# EAGLE design neopixel_board2 (EAGLE 9.2.0)
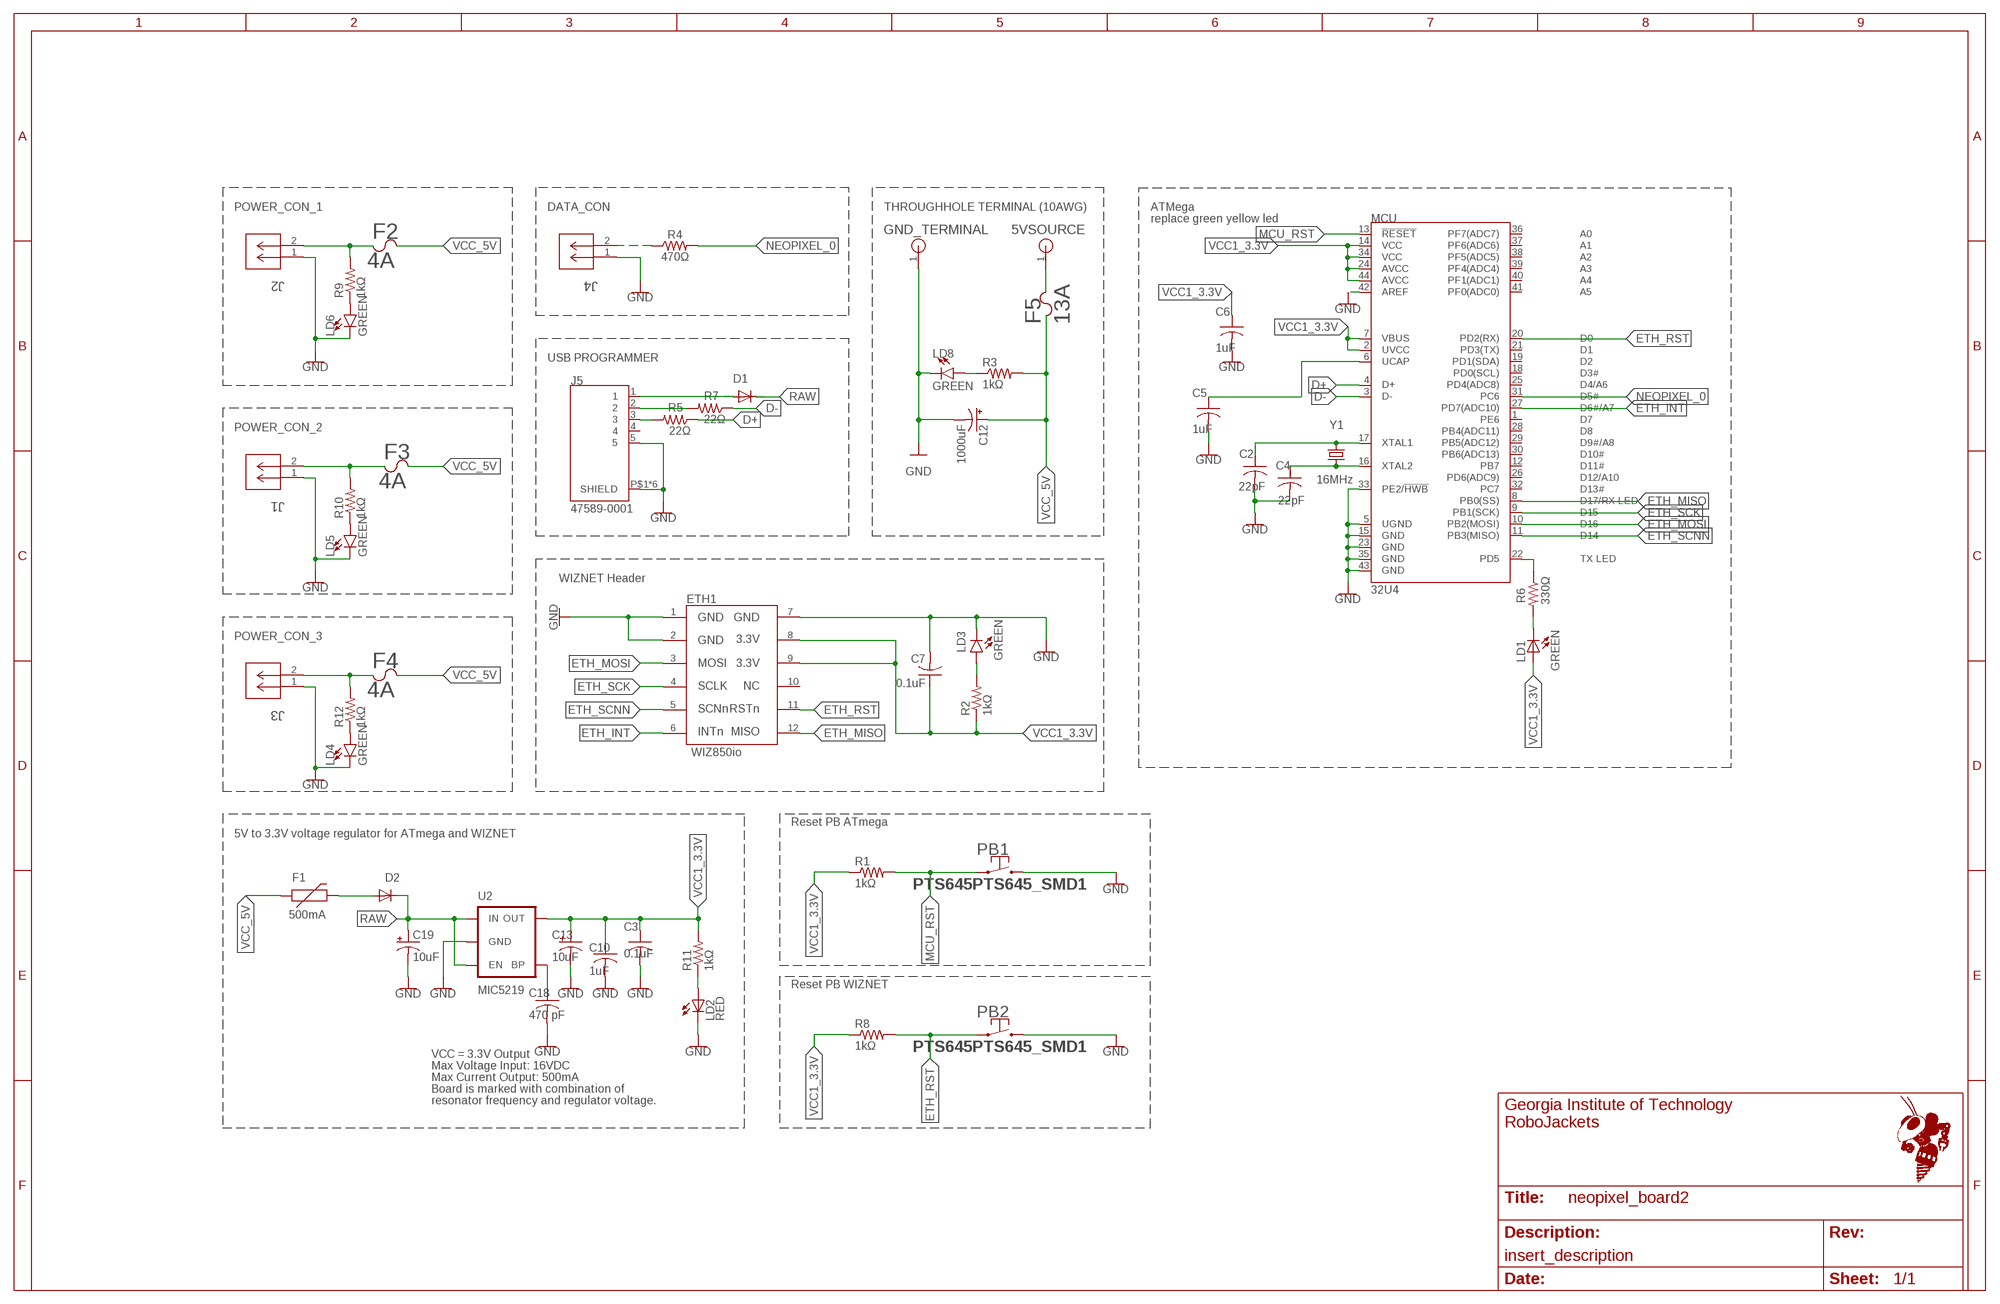
[diagram p0: schematic, sheet 1]
FRAME2 (FRAME_B_L): SCH_DESC: insert_description

## Parts
5VSOURCE  THOLE_SOURCE  [THOLE_SOURCE]
C2  22pF  C-USC0603  [C0603]
C3  0.1uF  C-USC0603  [C0603]
C4  22pF  C-USC0603  [C0603]
C5  1uF  C-USC0603  [C0603]
C6  1uF  C-USC0603  [C0603]
C7  0.1uF  C-USC0603  [C0603]
C10  1uF  C-USC0603  [C0603]
C12  1000uF  CAP_POL1206  [EIA3216]
C13  10uF  CAP_POL1206  [EIA3216]
C18  470 pF  C-USC0603  [C0603]
C19  10uF  CAP_POL1206  [EIA3216]
D1  DIODE-SOD110-W  [SOD110-W]
D2  DIODESOD  [SOD-323]
ETH1  WIZ850IO  [WIZ850IO]
F1  500mA  PTCSMD  [PTC-1206]
F2  4A  3557-2  [3557-2]
F3  4A  3557-2  [3557-2]
F4  4A  3557-2  [3557-2]
F5  13A  3557-2  [3557-2]
GND_TERMINAL  THOLE_SOURCE  [THOLE_SOURCE]
J1  SSW-102-02-T-S-RA  [CON2_1X2_TR_SSQ]
J2  SSW-102-02-T-S-RA  [CON2_1X2_TR_SSQ]
J3  SSW-102-02-T-S-RA  [CON2_1X2_TR_SSQ]
J4  SSW-102-02-T-S-RA  [CON2_1X2_TR_SSQ]
J5  47589-0001  [MOLEX_47589-0001]
LD1  GREEN  LED0603  [LED-0603]
LD2  RED  LED0603  [LED-0603]
LD3  GREEN  LED-GREEN0603  [LED-0603]
LD4  GREEN  LED-GREEN0603  [LED-0603]
LD5  GREEN  LED-GREEN0603  [LED-0603]
LD6  GREEN  LED-GREEN0603  [LED-0603]
LD8  GREEN  LED-GREEN0603  [LED-0603]
MCU  32U4  ATMEGA32U4TQFP-44  [TQFP44]
PB1  PTS645PTS645_SMD1  [PTS645_SMD]
PB2  PTS645PTS645_SMD1  [PTS645_SMD]
R1  1kΩ  R-US_R0603  [R0603]
R2  1kΩ  R-US_R0603  [R0603]
R3  1kΩ  RESISTOR0603-RES  [0603-RES]
R4  470Ω  470OHM-0603-1/10W-1%  [0603]
R5  22Ω  RESISTOR0603-RES  [0603-RES]
R6  330Ω  RESISTOR0603-RES  [0603-RES]
R7  22Ω  RESISTOR0603-RES  [0603-RES]
R8  1kΩ  R-US_R0603  [R0603]
R9  1kΩ  RESISTOR0603-RES  [0603-RES]
R10  1kΩ  RESISTOR0603-RES  [0603-RES]
R11  1kΩ  RESISTOR0603-RES  [0603-RES]
R12  1kΩ  RESISTOR0603-RES  [0603-RES]
U2  MIC5219  V_REG_LDOSMD  [SOT23-5]
Y1  16MHz  CRYSTAL5X3  [CRYSTAL-SMD-5X3]

## Nets
5VIN: 5VSOURCE.1 F5.1 F5.2
D+: MCU.4(D+) R5.1
D-: MCU.3(D-) R7.1
ETH_INT: ETH1.6 MCU.27(PD7(ADC10))
ETH_MISO: ETH1.12 MCU.8(PB0(SS))
ETH_MOSI: ETH1.3 MCU.10(PB2(MOSI))
ETH_RST: ETH1.11 MCU.20(PD2(RX)) PB2.P$1 PB2.P$2 R8.2
ETH_SCK: ETH1.4 MCU.9(PB1(SCK))
ETH_SCNN: ETH1.5 MCU.11(PB3(MISO))
GND [vcc]: C2.2 C3.2 C4.2 C5.2 C6.2 C7.2 C10.2 C12.C(-) C13.C(-) C18.2 C19.C(-) ETH1.1 ETH1.2 ETH1.7 GND_TERMINAL.1 J1.1 J2.1 J3.1 J4.1 J5.5 J5.P$1(SHIELD) J5.P$2(SHIELD) J5.P$3(SHIELD) J5.P$4(SHIELD) J5.P$5(SHIELD) J5.P$6(SHIELD) LD2.C LD3.C LD4.C LD5.C LD6.C LD8.C MCU.5(UGND) MCU.15(GND) MCU.23(GND) MCU.33(PE2/!HWB) MCU.35(GND) MCU.42(AREF) MCU.43(GND) PB1.P$3 PB1.P$4 PB2.P$3 PB2.P$4 U2.2(GND)
MCU_RST: MCU.13(!RESET) PB1.P$1 PB1.P$2 R1.2
N$1: C4.1 MCU.16(XTAL2) Y1.1
N$2: C2.1 MCU.17(XTAL1) Y1.3
N$4: C5.1 MCU.6(UCAP)
N$5: C18.1 U2.4(BP)
N$6: J5.2 R7.2
N$7: LD1.C R6.2
N$8: J5.3 R5.2
N$9: D2.2(A) F1.2
N$10: F2.1 F2.2 J2.2 R9.2
N$11: F3.1 F3.2 J1.2 R10.2
N$12: F4.1 F4.2 J3.2 R12.2
N$13: J4.2 R4.1
N$14: LD4.A R12.1
N$15: LD5.A R10.1
N$16: LD6.A R9.1
N$17: D1.A J5.1
N$18: LD3.A R2.2
N$21: LD8.A R3.1
N$38: LD2.A R11.1
NEOPIXEL_0: MCU.31(PC6) R4.2
RAW [vcc]: C19.A(+) D1.C D2.1(C) U2.1(IN) U2.3(EN)
TXLED: MCU.22(PD5) R6.1
VCC1_3.3V: C3.1 C6.1 C7.1 C10.1 C13.A(+) ETH1.8 ETH1.9 LD1.A MCU.2(UVCC) MCU.7(VBUS) MCU.14(VCC) MCU.24(AVCC) MCU.34(VCC) MCU.44(AVCC) R1.1 R2.1 R8.1 R11.2 U2.5(OUT)
VCC_5V: C12.A(+) F1.1 F2.3 F2.4 F3.3 F3.4 F4.3 F4.4 F5.3 F5.4 R3.2
Unconnected: ETH1.10 J5.4 MCU.1(PE6) MCU.12(PB7) MCU.18(PD0(SCL)) MCU.19(PD1(SDA)) MCU.21(PD3(TX)) MCU.25(PD4(ADC8)) MCU.26(PD6(ADC9)) MCU.28(PB4(ADC11)) MCU.29(PB5(ADC12)) MCU.30(PB6(ADC13)) MCU.32(PC7) MCU.36(PF7(ADC7)) MCU.37(PF6(ADC6)) MCU.38(PF5(ADC5)) MCU.39(PF4(ADC4)) MCU.40(PF1(ADC1)) MCU.41(PF0(ADC0))

## Notes on the sheet
- POWER_CON_1 | DATA_CON | THROUGHHOLE TERMINAL (10AWG) | ATMega
- replace green yellow led
- USB PROGRAMMER
- POWER_CON_2
- WIZNET Header
- POWER_CON_3
- Reset PB ATmega
- 5V to 3.3V voltage regulator for ATmega and WIZNET
- Reset PB WIZNET
- VCC = 3.3V Output
- Max Voltage Input: 16VDC
- Max Current Output: 500mA
- Board is marked with combination of
- resonator frequency and regulator voltage.

## Library data of the parts
5VSOURCE GND_TERMINAL = neopixel_board:THOLE_SOURCE
C2-C6 C10 = rcl:C-US: CAPACITOR, American symbol; SPICEPREFIX: C
C7 C18 = rcl:C-US: CAPACITOR, American symbol; SPICEPREFIX: 0.1 uF
C12 C13 C19 = SparkFun:CAP_POL: Capacitor Polarized These are standard SMD and PTH capacitors. Normally 10uF, 47uF, and 100uF in electrolytic and tantalum varieties. Always verify the external diameter of the through hole cap, it varies with capacity, voltage, and manufacturer. The EIA devices should be standard.
D1 = diode:DIODE-: DIODE
D2 = SparkFun:DIODE: Diode These are standard reverse protection diodes and small signal diodes. SMA package can handle up to about 1A. SOD-323 can handle about 200mA. What the SOD-323 package when ordering, there are some mfgs out there that are 5-pin packages.
ETH1 = WIZ850io:WIZ850IO
F1 = SparkFun:PTC: Resettable Fuse PTC Resettable Fuse. Spark Fun Electronics SKU : COM-08357
F2-F5 = neopixel_board:3557-2; DIGIKEY: 36-3557-2-ND; MPN: 3557-2
J1-J4 = neopixel_board:SSW-102-02-T-S-RA: 2 postion, right-angle, female header; MANUFACTURER_PART_NUMBER: SSW10202TSRA; VENDOR: Samtec Inc
J5 = 47589-0001:47589-0001: Stainless Steel Extractor for Camera Socket, 6.5x6.5 Type, Lead free; DESCRIPTION: Stainless Steel Extractor for Camera Socket, 6.5x6.5 Type, Lead free; MF: Molex; MP: 47589-0001; PACKAGE: None
LD1 LD2 = SparkFun:LED: LEDs Standard schematic elements and footprints for 5mm, 3mm, 1206, and 0603 sized LEDs. 5mm - Spark Fun Electronics SKU : COM-00529 (and others)
LD3-LD6 LD8 = SparkFun-LED:LED-GREEN: Green SMD LED Used in manufacturing of various products at SparkFun Packages: 0603 - SMD 0603 package [Product Link] <http://www.futureelectronics.com/en/technologies/semiconductors/optoelectronics/leds/Pages/9894312-LTST-C190GKT.aspx?CrossPart=HSMG-C190&IM=0> LilyPad 1206 - SMD1206 LilyPad package [Product Link] <http://www.futureelectronics.com/en/Technologies/Product.aspx?ProductID=IN150NGHARVATEKCORPORATION2049943&IM=0> 1206 - SMD1206 package [Product Link] <http://www.futureelectronics.com/en/technologies/semiconductors/optoelectronics/leds/Pages/8315665-LTST-C150KGKT.aspx?IM=0> 1206 Bottom Mount -SMD 1206 Bottom Mount [Product Link] <http://www.digikey.com/product-detail/en/lite-on-inc/LTST-C230KGKT/160-1456-1-ND/386854> SparkFun Products: Pro Mini 328 -5V <https://www.sparkfun.com/products/821> RedBoard <https://www.sparkfun.com/products/12757> MP3 Trigger <https://www.sparkfun.com/products/13720> Makey Makey <https://www.sparkfun.com/products/11076>; PROD_ID: DIO-00821
MCU = SparkFun-IC-Microcontroller:ATMEGA32U4: Atmel MCU, 32KByte Atmel 44-pin 8-bit Microcontroller with 32KBytes of ISP Flash and USB Controller Datasheet <http://cdn.sparkfun.com/datasheets/Dev/Arduino/Boards/ATMega32U4.pdf> SparkFun Products LilyPad Arduino USB - ATmega32U4 Board <https://www.sparkfun.com/products/12049> (DEV-12049) Pro Micro - 5V/16MHz <https://www.sparkfun.com/products/12640> (DEV-12640) Pro Micro - 3.3V/8MHz <https://www.sparkfun.com/products/12587> (DEV-12587) Fio v3 - ATmega32U4 <https://www.sparkfun.com/products/11520> (DEV-11520) Qduino Mini <https://www.sparkfun.com/products/13614> (DEV-13614) Makey Makey - Standard Kit <https://www.sparkfun.com/products/11511> (WIG-11511) Makey Makey Deluxe Kit <https://www.sparkfun.com/products/11519> (WIG-11519); PROD_ID: IC-11161
PB1 PB2 = Training_Board:PTS645: Tactile Momentary Pushbutton with thru-hole legs. https://www.ckswitches.com/media/1471/pts645.pdf
R1 R8 = rcl:R-US_: RESISTOR, American symbol; SPICEPREFIX: R
R2 = rcl:R-US_: RESISTOR, American symbol; SPICEPREFIX: 1k
R3 R5-R7 R9-R12 = SparkFun:RESISTOR: Resistor Basic schematic elements and footprints for 0603, 1206, and PTH resistors.
R4 = SparkFun-Resistors:470OHM: 470Ω resistor A resistor is a passive two-terminal electrical component that implements electrical resistance as a circuit element. Resistors act to reduce current flow, and, at the same time, act to lower voltage levels within circuits. - Wikipedia; PROD_ID: RES-07869; VALUE: 470
U2 = SparkFun:V_REG_LDO: Voltage Regulator LDO Standard 150mA LDO voltage regulator in SOT-23 layout. Micrel part MIC5205. BP (by-pass) pin is used to lower output noise with 470pF cap.
Y1 = SparkFun:CRYSTAL: Crystals Various standard crystals. Proven footprints. Spark Fun Electronics SKU : COM-00534

## Net classes
0 default: width 0.203 mm

## Board
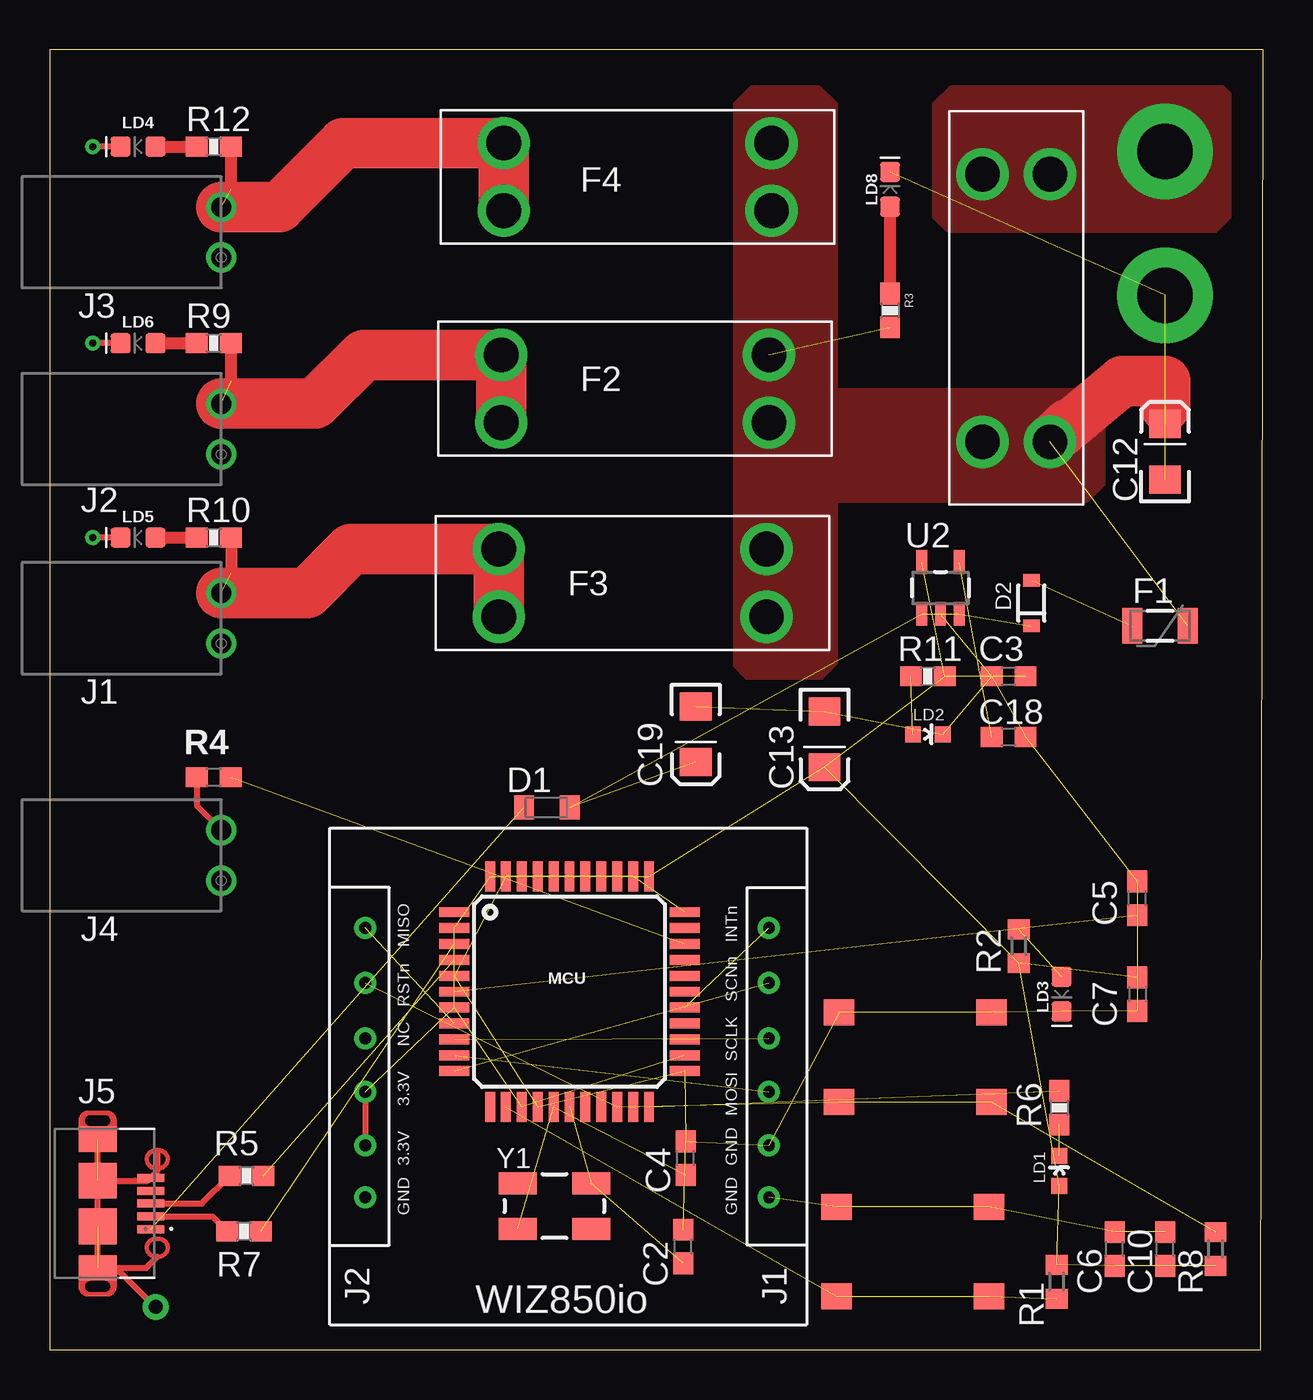
[diagram p1: board, top side]
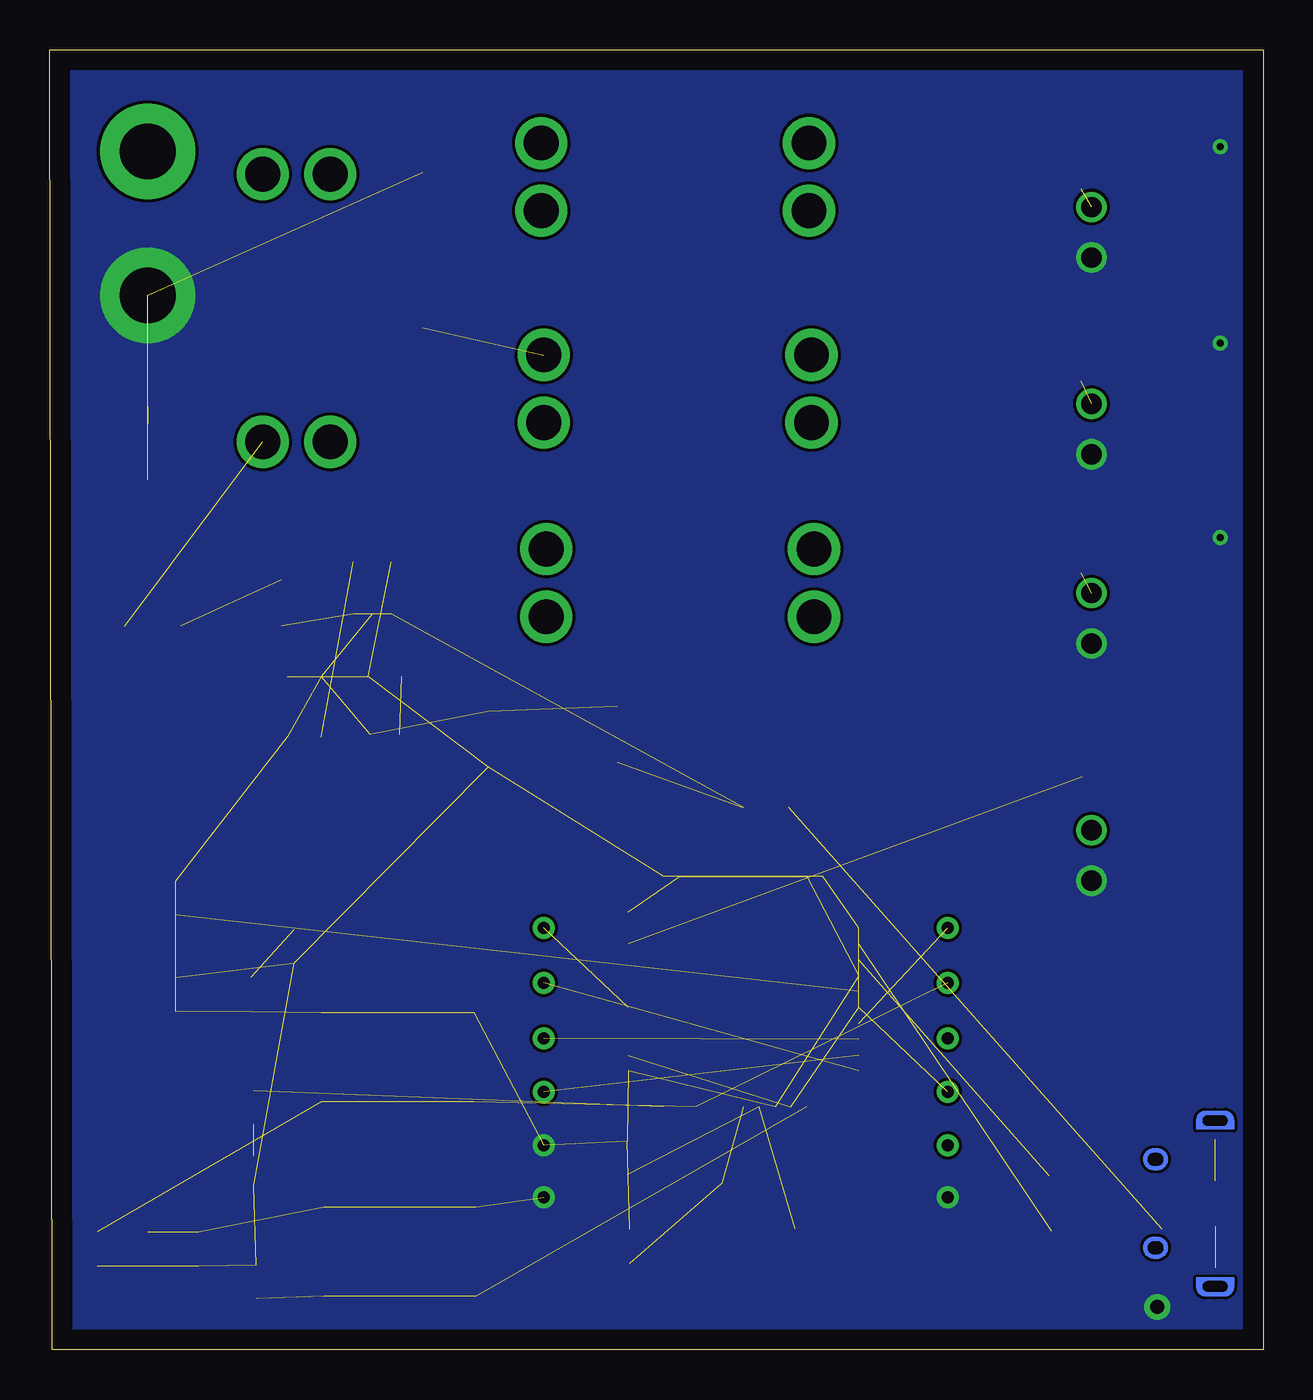
[diagram p2: board, bottom side, seen from below]

Size 61.07 x 65.46 mm. Coordinates in mm from the lower left corner, seen from the top.
Outline: 0,0 60.94,0 61.07,65.46 0,65.46 0,0
Copper layers (1*16): Top 0.035mm / dielectric 1.5mm / Bottom 0.035mm
Design rules "default *": minimum track width 6mil, minimum drill 0.35mm, track to track 6mil, track to pad 6mil, pad to pad 6mil, via to via 6mil, smd to smd 6mil, copper to edge 40mil, drill to drill 6mil, minimum pad ring 10mil, minimum via ring 8mil, stop-mask expansion 4mil, vias tented up to drill 0mil, thermal gap 0mil

### Footprints (pad centres in the part's own frame; a part is rotated, then mirrored left to right if it is on the bottom)
THOLE_SOURCE = drill 2.8 pad 4.8: 1 0,0
C0603 = smd 1.1 x 1: 1 -0.85,0; 2 0.85,0
EIA3216 = smd 1.4 x 1.6: A 1.4,0; C -1.4,0
SOD110-W = smd 1 x 1.2: A 1.15,0; C -1.15,0
SOD-323 = smd 0.63 x 0.83: 1 -1.15,0; 2 1.15,0
WIZ850IO = drill 0.6: 1 6.4,1.9; 2 9.02,1.9; 3 11.72,1.9; 4 14.42,1.9; 5 17.2,1.9; 6 19.98,1.9; 7 6.4,22.22; 8 9.02,22.22; 9 11.72,22.22; 10 14.42,22.22; 11 17.2,22.22; 12 19.98,22.22
PTC-1206 = smd 1 x 1.8: 1 -1.4,0; 2 1.4,0
3557-2 = drill 1.75: 1 -6.735,1.7; 2 -6.735,-1.7; 3 6.735,-1.7; 4 6.735,1.7
CON2_1X2_TR_SSQ = drill 1.016 pad 1.524: 1 -1.27,0; 2 1.27,0
MOLEX_47589-0001 = smd 1.35 x 0.4: 1 2.675,-1.3; 2 2.675,-0.65; 3 2.675,0; 4 2.675,0.65; 5 2.675,1.3 | smd 0.01 x 0.01: P$1 3,2.675; P$2 3,-2.675 | smd 1.9 x 1.275: P$3 0,3.237; P$6 0,-3.237 | smd 1.9 x 1.8: P$4 0,1.15; P$5 0,-1.15
LED-0603 = smd 0.8 x 0.8: A 0,-0.75; C 0,0.75
LED-0603' = smd 1 x 1: A -0.877,0; C 0.877,0
TQFP44 = smd 1.5 x 0.5: 1 -5.8,4; 2 -5.8,3.2; 3 -5.8,2.4; 4 -5.8,1.6; 5 -5.8,0.8; 6 -5.8,0; 7 -5.8,-0.8; 8 -5.8,-1.6; 9 -5.8,-2.4; 10 -5.8,-3.2; 11 -5.8,-4; 23 5.8,-4; 24 5.8,-3.2; 25 5.8,-2.4; 26 5.8,-1.6; 27 5.8,-0.8; 28 5.8,0; 29 5.8,0.8; 30 5.8,1.6; 31 5.8,2.4; 32 5.8,3.2; 33 5.8,4 | smd 0.5 x 1.5: 12 -4,-5.8; 13 -3.2,-5.8; 14 -2.4,-5.8; 15 -1.6,-5.8; 16 -0.8,-5.8; 17 0,-5.8; 18 0.8,-5.8; 19 1.6,-5.8; 20 2.4,-5.8; 21 3.2,-5.8; 22 4,-5.8; 34 4,5.8; 35 3.2,5.8; 36 2.4,5.8; 37 1.6,5.8; 38 0.8,5.8; 39 0,5.8; 40 -0.8,5.8; 41 -1.6,5.8; 42 -2.4,5.8; 43 -3.2,5.8; 44 -4,5.8
PTS645_SMD = smd 1.55 x 1.3: P$1 -3.835,2.25; P$2 3.835,2.25; P$3 3.835,-2.25; P$4 -3.835,-2.25
R0603 = smd 1 x 1.1: 1 -0.85,0; 2 0.85,0
0603-RES = smd 1.1 x 1: 1 -0.85,0; 2 0.85,0
0603 = smd 1.1 x 1: 1 -0.85,0; 2 0.85,0
SOT23-5 = smd 0.55 x 1.2: 1 -0.95,-1.3; 2 0,-1.3; 3 0.95,-1.3; 4 0.95,1.3; 5 -0.95,1.3
CRYSTAL-SMD-5X3 = smd 1.9 x 1.1: 1 -1.85,-1.15; 2 1.85,-1.15; 3 1.85,1.15; 4 -1.85,1.15

### Placement (x,y rotation side)
5VSOURCE  56.13,60.33 0 top
C2  31.88,5.21 90 top
C3  48.26,33.91 180 top
C4  32,9.65 90 top
C5  54.74,22.73 90 top
C6  53.59,5.08 90 top
C7  54.74,17.91 270 top
C10  56.13,5.08 90 top
C12  56.13,45.21 90 top
C13  38.99,30.73 270 top
C18  48.26,30.86 0 top
C19  32.51,30.99 270 top
D1  25.02,27.3 180 top
D2  49.4,37.59 90 top
ETH1  38.1,1.27 90 top
F1  55.88,36.45 180 top
F2  29.46,48.39 0 top
F3  29.34,38.61 0 top
F4  29.59,59.05 0 top
F5  48.64,52.45 270 top
GND_TERMINAL  56.13,53.09 0 top
J1  8.64,36.83 90 top
J2  8.64,46.35 90 top
J3  8.64,56.26 90 top
J4  8.64,24.89 90 top
J5  2.41,7.37 0 top
LD1  50.8,9.02 0 top
LD2  44.2,30.99 270 top
LD3  GREEN  [LED-0603']  50.93,17.91 270 top
LD4  GREEN  [LED-0603']  4.45,60.58 180 top
LD5  GREEN  [LED-0603']  4.45,40.89 180 top
LD6  GREEN  [LED-0603']  4.45,50.67 180 top
LD8  GREEN  [LED-0603']  42.29,58.42 90 top
MCU  26.16,18.03 0 top
PB1  43.43,4.95 180 top
PB2  43.56,14.73 180 top
R1  50.67,3.43 270 top
R2  48.77,20.32 90 top
R3  42.29,52.32 270 top
R4  8.26,28.83 0 top
R5  9.91,8.76 180 top
R6  50.8,12.19 270 top
R7  9.78,5.97 180 top
R8  58.67,5.08 90 top
R9  8.26,50.67 0 top
R10  8.26,40.89 0 top
R11  44.2,33.91 0 top
R12  8.26,60.58 0 top
U2  44.83,38.35 0 top
Y1  25.4,7.24 0 top

### Tracks (layer width: path | path; a pad name or v marks a point on that pad's centre or on a via)
5VIN
  pour Top (no thermals): 44.45,62.74 44.45,57.02 45.21,56.26 58.67,56.26 59.44,57.02 59.44,63.25 59.05,63.63 45.34,63.63
D+  (1 unrouted)
D-  (1 unrouted)
ETH_INT  (1 unrouted)
ETH_MISO  (1 unrouted)
ETH_MOSI  (1 unrouted)
ETH_RST  (4 unrouted)
ETH_SCK  (1 unrouted)
ETH_SCNN  (1 unrouted)
GND  (via drill 0.35, 0.7 pad 1.3)  (28 unrouted)
  Top 0.305: LD5.C v2.16,40.89 | LD6.C v2.16,50.67 | LD4.C v2.16,60.58 | J5.P$6 J5.P$3 | J5.P$6 2.6,3.95 3.49,3.95 5.28,2.16 v5.33,2.16 | J5.P$1 5.41,8.99 J5.5 4.94,8.52 4.29,8.52 4.28,8.52 J5.P$4 | J5.P$6 4.85,4.13 J5.P$2
  pour Bottom (no thermals): 0.13,65.28 0.13,0.13 60.45,0.13 60.71,0.38 60.71,65.02 60.45,65.28
MCU_RST  (3 unrouted)
N$1  (2 unrouted)
N$2  (2 unrouted)
N$4  (1 unrouted)
N$5  (1 unrouted)
N$6
  Top 0.305: J5.2 8.18,6.72 R7.2
N$7  (1 unrouted)
N$8
  Top 0.305: J5.3 7.66,7.37 R5.2
N$9  (1 unrouted)
N$10  (1 unrouted)
  Top 0.61: R9.2 9.11,48.81 9.14,48.77
  Top 2.54: F2.2 F2.1 15.8,50.09 13.34,47.62 J2.2
N$11  (1 unrouted)
  Top 0.61: R10.2 9.14,40.85 9.14,39.12
  Top 2.54: F3.2 F3.1 15.16,40.31 12.95,38.1 J1.2
N$12  (1 unrouted)
  Top 0.61: 9.02,60.54 R12.2 9.11,58.46 9.14,58.42
  Top 2.54: J3.2 11.56,57.53 14.78,60.76 F4.1 F4.2
N$13
  Top 0.305: R4.1 7.41,27.39 J4.2
N$14
  Top 0.61: LD4.A R12.1
N$15
  Top 0.61: LD5.A R10.1
N$16
  Top 0.61: LD6.A R9.1
N$17  (1 unrouted)
N$18  (1 unrouted)
N$21
  Top 0.61: R3.1 LD8.A
N$38  (1 unrouted)
NEOPIXEL_0  (1 unrouted)
RAW  (4 unrouted)
TXLED  (1 unrouted)
VCC1_3.3V  (17 unrouted)
  Top 0.305: ETH1.9 ETH1.8
VCC_5V  (3 unrouted)
  Top 2.54: 51.24,46.61 F5.4 53.97,48.77 56.13,48.77 56.13,47.5
  pour Top (no thermals): 35.31,63.63 34.42,62.74 34.42,34.42 35.05,33.78 38.86,33.78 39.62,34.54 39.62,62.74 38.73,63.63
  pour Top (no thermals): 39.24,42.67 52.2,42.67 53.09,43.56 53.09,47.88 52.58,48.39 39.5,48.39 39.5,42.93